# Altium schematic sheet 00_TOP.SchDoc
size OrCAD B
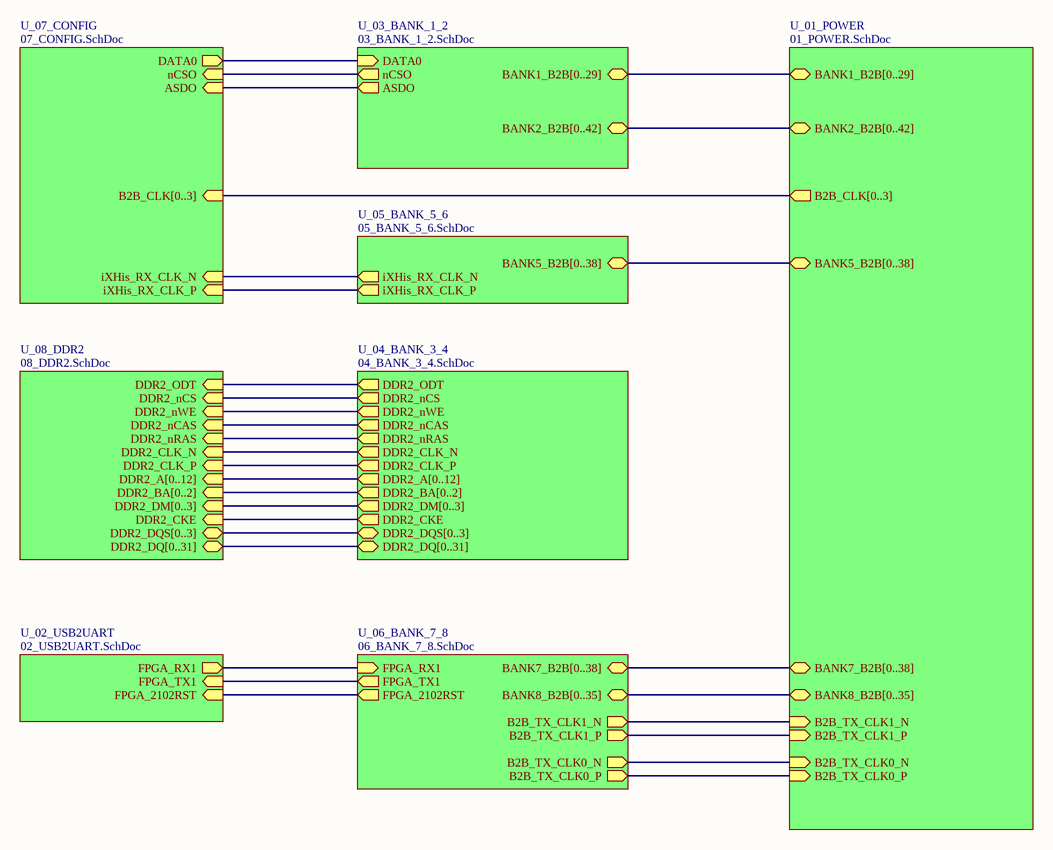
[diagram p0: 00_TOP.SchDoc]

## Sub-sheets
U_01_POWER = 01_POWER.SchDoc: B2B_CLK[0..3] (out), BANK1_B2B[0..29] (bidir), BANK2_B2B[0..42] (bidir), BANK5_B2B[0..38] (bidir), BANK7_B2B[0..38] (bidir), B2B_TX_CLK1_N (in), B2B_TX_CLK1_P (in), B2B_TX_CLK0_N (in), B2B_TX_CLK0_P (in), BANK8_B2B[0..35] (bidir)
U_02_USB2UART = 02_USB2UART.SchDoc: FPGA_TX1 (in), FPGA_RX1 (out), FPGA_2102RST (in)
U_03_BANK_1_2 = 03_BANK_1_2.SchDoc: ASDO (out), nCSO (out), DATA0 (in), BANK1_B2B[0..29] (bidir), BANK2_B2B[0..42] (bidir)
U_04_BANK_3_4 = 04_BANK_3_4.SchDoc: DDR2_ODT (out), DDR2_nCS (out), DDR2_nWE (out), DDR2_nCAS (out), DDR2_nRAS (out), DDR2_CLK_N (out), DDR2_CLK_P (out), DDR2_A[0..12] (out), DDR2_BA[0..2] (out), DDR2_DQS[0..3] (bidir), DDR2_DM[0..3] (out), DDR2_CKE (out), DDR2_DQ[0..31] (bidir)
U_05_BANK_5_6 = 05_BANK_5_6.SchDoc: iXHis_RX_CLK_P (out), iXHis_RX_CLK_N (out), BANK5_B2B[0..38] (bidir)
U_06_BANK_7_8 = 06_BANK_7_8.SchDoc: BANK7_B2B[0..38] (bidir), B2B_TX_CLK1_N (out), B2B_TX_CLK1_P (out), B2B_TX_CLK0_N (out), B2B_TX_CLK0_P (out), BANK8_B2B[0..35] (bidir), FPGA_TX1 (out), FPGA_RX1 (in), FPGA_2102RST (out)
U_07_CONFIG = 07_CONFIG.SchDoc: ASDO (in), nCSO (in), DATA0 (out), iXHis_RX_CLK_P (in), iXHis_RX_CLK_N (in), B2B_CLK[0..3] (in)
U_08_DDR2 = 08_DDR2.SchDoc: DDR2_ODT (in), DDR2_nCS (in), DDR2_nWE (in), DDR2_nCAS (in), DDR2_nRAS (in), DDR2_CLK_N (in), DDR2_CLK_P (in), DDR2_A[0..12] (in), DDR2_BA[0..2] (in), DDR2_DQS[0..3] (bidir), DDR2_DM[0..3] (in), DDR2_CKE (in), DDR2_DQ[0..31] (bidir)

## Nets
(unnamed): sheet U_01_POWER/B2B_TX_CLK1_N, sheet U_06_BANK_7_8/B2B_TX_CLK1_N
(unnamed): sheet U_01_POWER/B2B_TX_CLK1_P, sheet U_06_BANK_7_8/B2B_TX_CLK1_P
(unnamed): sheet U_01_POWER/B2B_TX_CLK0_N, sheet U_06_BANK_7_8/B2B_TX_CLK0_N
(unnamed): sheet U_01_POWER/B2B_TX_CLK0_P, sheet U_06_BANK_7_8/B2B_TX_CLK0_P
(unnamed): sheet U_02_USB2UART/FPGA_TX1, sheet U_06_BANK_7_8/FPGA_TX1
(unnamed): sheet U_02_USB2UART/FPGA_RX1, sheet U_06_BANK_7_8/FPGA_RX1
(unnamed): sheet U_02_USB2UART/FPGA_2102RST, sheet U_06_BANK_7_8/FPGA_2102RST
(unnamed): sheet U_03_BANK_1_2/ASDO, sheet U_07_CONFIG/ASDO
(unnamed): sheet U_03_BANK_1_2/nCSO, sheet U_07_CONFIG/nCSO
(unnamed): sheet U_03_BANK_1_2/DATA0, sheet U_07_CONFIG/DATA0
(unnamed): sheet U_04_BANK_3_4/DDR2_ODT, sheet U_08_DDR2/DDR2_ODT
(unnamed): sheet U_04_BANK_3_4/DDR2_nCS, sheet U_08_DDR2/DDR2_nCS
(unnamed): sheet U_04_BANK_3_4/DDR2_nWE, sheet U_08_DDR2/DDR2_nWE
(unnamed): sheet U_04_BANK_3_4/DDR2_nCAS, sheet U_08_DDR2/DDR2_nCAS
(unnamed): sheet U_04_BANK_3_4/DDR2_nRAS, sheet U_08_DDR2/DDR2_nRAS
(unnamed): sheet U_04_BANK_3_4/DDR2_CLK_N, sheet U_08_DDR2/DDR2_CLK_N
(unnamed): sheet U_04_BANK_3_4/DDR2_CLK_P, sheet U_08_DDR2/DDR2_CLK_P
(unnamed): sheet U_04_BANK_3_4/DDR2_CKE, sheet U_08_DDR2/DDR2_CKE
(unnamed): sheet U_05_BANK_5_6/iXHis_RX_CLK_P, sheet U_07_CONFIG/iXHis_RX_CLK_P
(unnamed): sheet U_05_BANK_5_6/iXHis_RX_CLK_N, sheet U_07_CONFIG/iXHis_RX_CLK_N

## Buses and harness runs
bus sheet U_01_POWER/B2B_CLK[0..3] = sheet U_07_CONFIG/B2B_CLK[0..3]
bus sheet U_01_POWER/BANK1_B2B[0..29] = sheet U_03_BANK_1_2/BANK1_B2B[0..29]
bus sheet U_01_POWER/BANK2_B2B[0..42] = sheet U_03_BANK_1_2/BANK2_B2B[0..42]
bus sheet U_01_POWER/BANK5_B2B[0..38] = sheet U_05_BANK_5_6/BANK5_B2B[0..38]
bus sheet U_01_POWER/BANK7_B2B[0..38] = sheet U_06_BANK_7_8/BANK7_B2B[0..38]
bus sheet U_01_POWER/BANK8_B2B[0..35] = sheet U_06_BANK_7_8/BANK8_B2B[0..35]
bus sheet U_04_BANK_3_4/DDR2_A[0..12] = sheet U_08_DDR2/DDR2_A[0..12]
bus sheet U_04_BANK_3_4/DDR2_BA[0..2] = sheet U_08_DDR2/DDR2_BA[0..2]
bus sheet U_04_BANK_3_4/DDR2_DM[0..3] = sheet U_08_DDR2/DDR2_DM[0..3]
bus sheet U_04_BANK_3_4/DDR2_DQ[0..31] = sheet U_08_DDR2/DDR2_DQ[0..31]
bus sheet U_04_BANK_3_4/DDR2_DQS[0..3] = sheet U_08_DDR2/DDR2_DQS[0..3]